# Altium schematic sheet [03] POWER.SchDoc
size A4; SheetNumber: 4
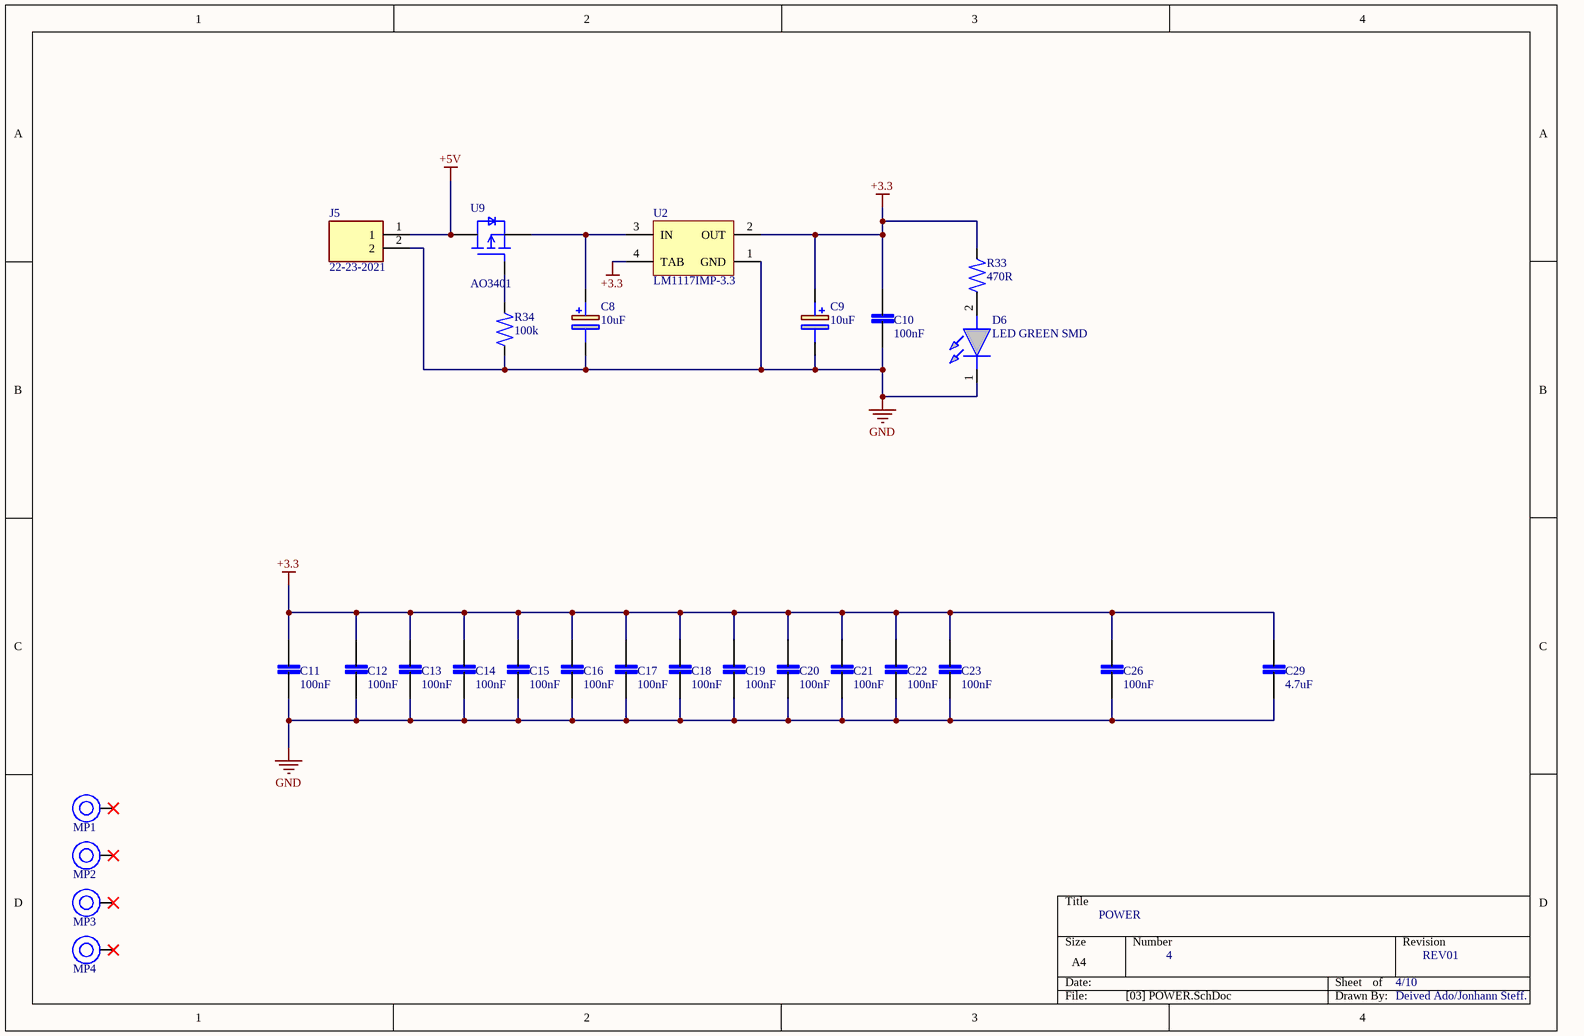
[diagram p0: [03] POWER.SchDoc]

## Parts
C8  10uF  [CAP_E_830X650N]
C9  10uF  [CAP_E_830X650N]
C10  100nF  [cap_0603]
C11  100nF  [cap_0603]
C12  100nF  [cap_0603]
C13  100nF  [cap_0603]
C14  100nF  [cap_0603]
C15  100nF  [cap_0603]
C16  100nF  [cap_0603]
C17  100nF  [cap_0603]
C18  100nF  [cap_0603]
C19  100nF  [cap_0603]
C20  100nF  [cap_0603]
C21  100nF  [cap_0603]
C22  100nF  [cap_0603]
C23  100nF  [cap_0603]
C26  100nF  [cap_0603]
C29  4.7uF  [cap_0603]
D6  LED GREEN SMD  [LED 0805]
J5  22-23-2021  [SHDR2W87P0X254_1X2_493X635X1105P]
MP1  M3 x 5mm  [78614050360]  (value not drawn)
MP2  M3 x 5mm  [78614050360]  (value not drawn)
MP3  M3 x 5mm  [78614050360]  (value not drawn)
MP4  M3 x 5mm  [78614050360]  (value not drawn)
R33  470R  [RES_0603]
R34  100k  [RES_0603]
U2  LM1117IMP-3.3  [MP04A_N]
U9  AO3401  [SOT23-3]

## Nets
+3.3: C9.1(+) C10.2 C11.2 C12.2 C13.2 C14.2 C15.2 C16.2 C17.2 C18.2 C19.2 C20.2 C21.2 C22.2 C23.2 C26.2 C29.2 R33.2 U2.2(OUT) U2.4(TAB)
+5V: J5.1 U9.3(D)
GND: C8.2(-) C9.2(-) C10.1 C11.1 C12.1 C13.1 C14.1 C15.1 C16.1 C17.1 C18.1 C19.1 C20.1 C21.1 C22.1 C23.1 C26.1 C29.1 D6.1(K) J5.2 R34.1 U2.1(GND)
NetC8_1: C8.1(+) U2.3(IN) U9.2(S)
NetD6_2: D6.2(A) R33.1
NetR34_2: R34.2 U9.1(G)

Not connected (* = marked no-connect by the designer): MP1 1*; MP2 1*; MP3 1*; MP4 1*

## Notes on the sheet
- POWER
- 4
- 4/10
- REV01
- Deived Ado/Jonhann Steff.

## Library data of the parts
C8 C9 = C_CP
C10-C23 C26 C29 = C_Small: Generic capacitor symbol
D6 = LED GREEN SMD: LED Green 0805 Rectangular; Mfr. Part #: 15008GS75000; Manufacturer: Wurth Elektronik; Purchase-URL: https://br.mouser.com/ProductDetail/Wurth-Elektronik/150080GS75000?qs=2kOmHSv6VfQRoTEZVk1mGA%3D%3D; Datasheet: https://www.we-online.com/components/products/datasheet/150080GS75000.pdf; Price: 0,19
J5 = KK - HDR 2P: Headers & Wire Housings VERT PCB HDR 2P TIN FRICTION LOCK; Manufacturer: Molex; Price: 0,21; Purchase-URL: https://br.mouser.com/ProductDetail/Molex/22-23-2021?qs=ILqg114nvd4YKlRlbo3yMg%3D%3D; Mfr. Part #: 22-23-2021; Datasheet: https://tools.molex.com/pdm_docs/sd/022232021_sd.pdf
MP1-MP4 = 78614050360: WA-SMSA SMT Spacer Studs Automotive, OD 6mm, ID 4.2mm, M3 x 5mm; Manufacturer: Wurth Elektronik; Surface: Tin; Solder Cream Thickness Min: 150um; Tightenning Torque Max: 0.5N*m; Manufacturer Part Number: 78614050360; Category: SMT Spacers; Match Code: WA-SMSA; ComponentLink1Description: Website Link; ComponentLink1URL: https://www.we-online.com/redexpert/article/78614050360?ad; ComponentLink2Description: Datasheet Link; ComponentLink2URL: https://www.we-online.com/redexpert/spec/78614050360?ad; Mount: Surface Mount; Operating Temperature Max: 150°C; Operating Temperature Min: -55°C; Packaging: Tape and Reel; Height: 5mm; Automotive: Yes; Inside Diameter: 4.2mm; Material: Steel; Outside Diameter: 6mm; Thread Size: M3
R33 R34 = R_Small: Generic Resistor symbol
U2 = LM1117IMP-3.3: 800mA Low-Dropout Linear Regulator, 4-pin SOT-223; Manufacturer: National Semiconductor; PackageTopMarking: XYTT*N05B; PowerWise: N; CompType: LDO IC; Published: 4-Dec-2008; DatasheetVersion: Apr-2006; PackageVersion: revB, Apr-2003; PackageReference: MP04A; Publisher: Altium Limited; PackageDescription: Molded SOT-223, 6.50 x 3.56 x 1.6mm Body, 4 Lead, 2.3mm Pitch; Supplier 1: Farnell; Supplier Part Number 1: 7614123; PartNumber: LM1117IMP-3.3; RoHS: N; PinCount: 4; Code_JEDEC: TO-261-AA; Code_IPC: SOT223-4; ComponentLink1Description: LM1117 Datasheet; ComponentLink1URL: http://www.national.com/ds/LM/LM1117.pdf; ComponentLink2Description: LM1117 Web Page; ComponentLink2URL: http://www.national.com/pf/LM/LM1117.html; ComponentLink3Description: MP04A Package Page; ComponentLink3URL: http://www.national.com/packaging/folders/mp04a.html
U9 = AO3401: P-Channel 30 V 4A (Ta) 1.4W (Ta) Surface Mount SOT-23-3; MF: Alpha &; SnapEDA_Link: https://www.snapeda.com/parts/AO3401/Alpha+%2526+Omega+Semiconductor+Inc./view-part/?ref=snap; Package: TO-236-3 Alpha &amp; Omega Semiconductor Inc.; Value: *; MP: AO3401; Check_prices: https://www.snapeda.com/parts/AO3401/Alpha+%2526+Omega+Semiconductor+Inc./view-part/?ref=eda